# EAGLE schematic ItsyBitsy_Basic (EAGLE 9.6.2)
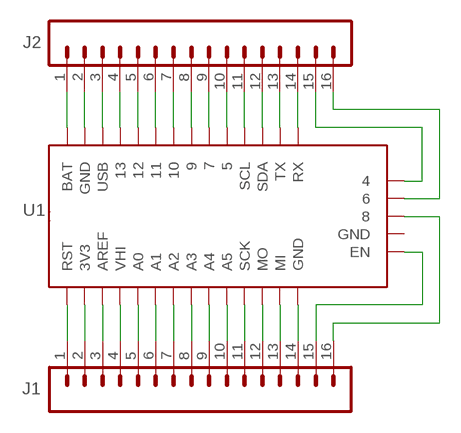
[diagram p0: schematic, sheet 1]

## Parts
J1  CONN_161X16_NO_SILK  [1X16_NO_SILK]
J2  CONN_161X16_NO_SILK  [1X16_NO_SILK]
U1  ITSYBITSY-32U4-3V  [ITSYBITYS-32U4]

## Nets
3V-5V: J1.2 U1.P$2(3V3)
4: J2.15 U1.P$19
5: J2.10 U1.P$24
6: J2.16 U1.P$18
7: J2.9 U1.P$25
8: J1.16 U1.P$17
9: J2.8 U1.P$26
10: J2.7 U1.P$27
11: J2.6 U1.P$28
12: J2.5 U1.P$29
13: J2.4 U1.P$30
A0: J1.5 U1.P$5(A0)
A1: J1.6 U1.P$6(A1)
A2: J1.7 U1.P$7(A2)
A3: J1.8 U1.P$8(A3)
A4: J1.9 U1.P$9(A4)
A5: J1.10 U1.P$10(A5)
AREF: J1.3 U1.P$3(AREF)
BAT: J2.1 U1.P$33(BAT)
EN: J1.15 U1.P$15(EN)
GND: J2.2 U1.P$32(GND)
GND-3V: J1.14 U1.P$14(GND)
M0: J1.12 U1.P$12(MO)
MI: J1.13 U1.P$13(MI)
RST: J1.1 U1.P$1(RST)
RX: J2.14 U1.P$20(RX)
SCK: J1.11 U1.P$11(SCK)
SCL: J2.11 U1.P$23(SCL)
SDA: J2.12 U1.P$22(SDA)
TX: J2.13 U1.P$21(TX)
USB: J2.3 U1.P$31(USB)
VHI-GND: J1.4 U1.P$4(VHI)

## Power pins joined to a net without a drawn wire
GND: U1.P$16(GND)

## Library data of the parts
J1 J2 = SparkFun-Connectors:CONN_16: Multi connection point. Often used as Generic Header-pin footprint for 0.1 inch spaced/style header connections On any of the 0.1 inch spaced packages, you can populate with these: Break Away Headers - Straight <https://www.sparkfun.com/products/116> (PRT-00116) Break Away Male Headers - Right Angle <https://www.sparkfun.com/products/553> (PRT-00553) Female Headers <https://www.sparkfun.com/products/115> (PRT-00115) Break Away Headers - Machine Pin <https://www.sparkfun.com/products/117> (PRT-00117) Break Away Female Headers - Swiss Machine Pin <https://www.sparkfun.com/products/743> (PRT-00743) For SCREWTERMINALS and SPRING TERMINALS visit here: Screw Terimnals on SparkFun.com <https://www.sparkfun.com/search/results?term=Screw+Terminals> (5mm/3.5mm/2.54mm spacing) This device is also useful as a general connection point to wire up your design to another part of your project. Our various solder wires solder well into these plated through hole pads. Hook-Up Wire - Assortment (Stranded, 22 AWG) <https://www.sparkfun.com/products/11375> (PRT-11375) Hook-Up Wire - Assortment (Solid Core, 22 AWG) <https://www.sparkfun.com/products/11367> (PRT-11367) View the entire wire category on our website here <https://www.sparkfun.com/categories/141> Special notes: Molex polarized connector foot print use with SKU : PRT-08231 with associated crimp pins and housings. 1MM SMD Version SKU: PRT-10208 NOTES ON THE VARIANTS LOCK and LOCK_LONGPADS... This footprint was designed to help hold the alignment of a through-hole component (i.e. 6-pin header) while soldering it into place. You may notice that each hole has been shifted either up or down by 0.005 of an inch from it's more standard position (which is a perfectly straight line). This slight alteration caused the pins (the squares in the middle) to touch the edges of the holes. Because they are alternating, it causes a "brace" to hold the component in place. 0.005 has proven to be the perfect amount of "off-center" position when using our standard breakaway headers. Although looks a little odd when you look at the bare footprint, once you have a header in there, the alteration is very hard to notice. Also,if you push a header all the way into place, it is covered up entirely on the bottom side.
U1 = home:ITSYBITSY-32U4-3V

## Net classes
0 default: width 0.203 mm